# EAGLE schematic 6_cpu_registers_b (EAGLE 6.6.0)

## Sheet 1 of 2
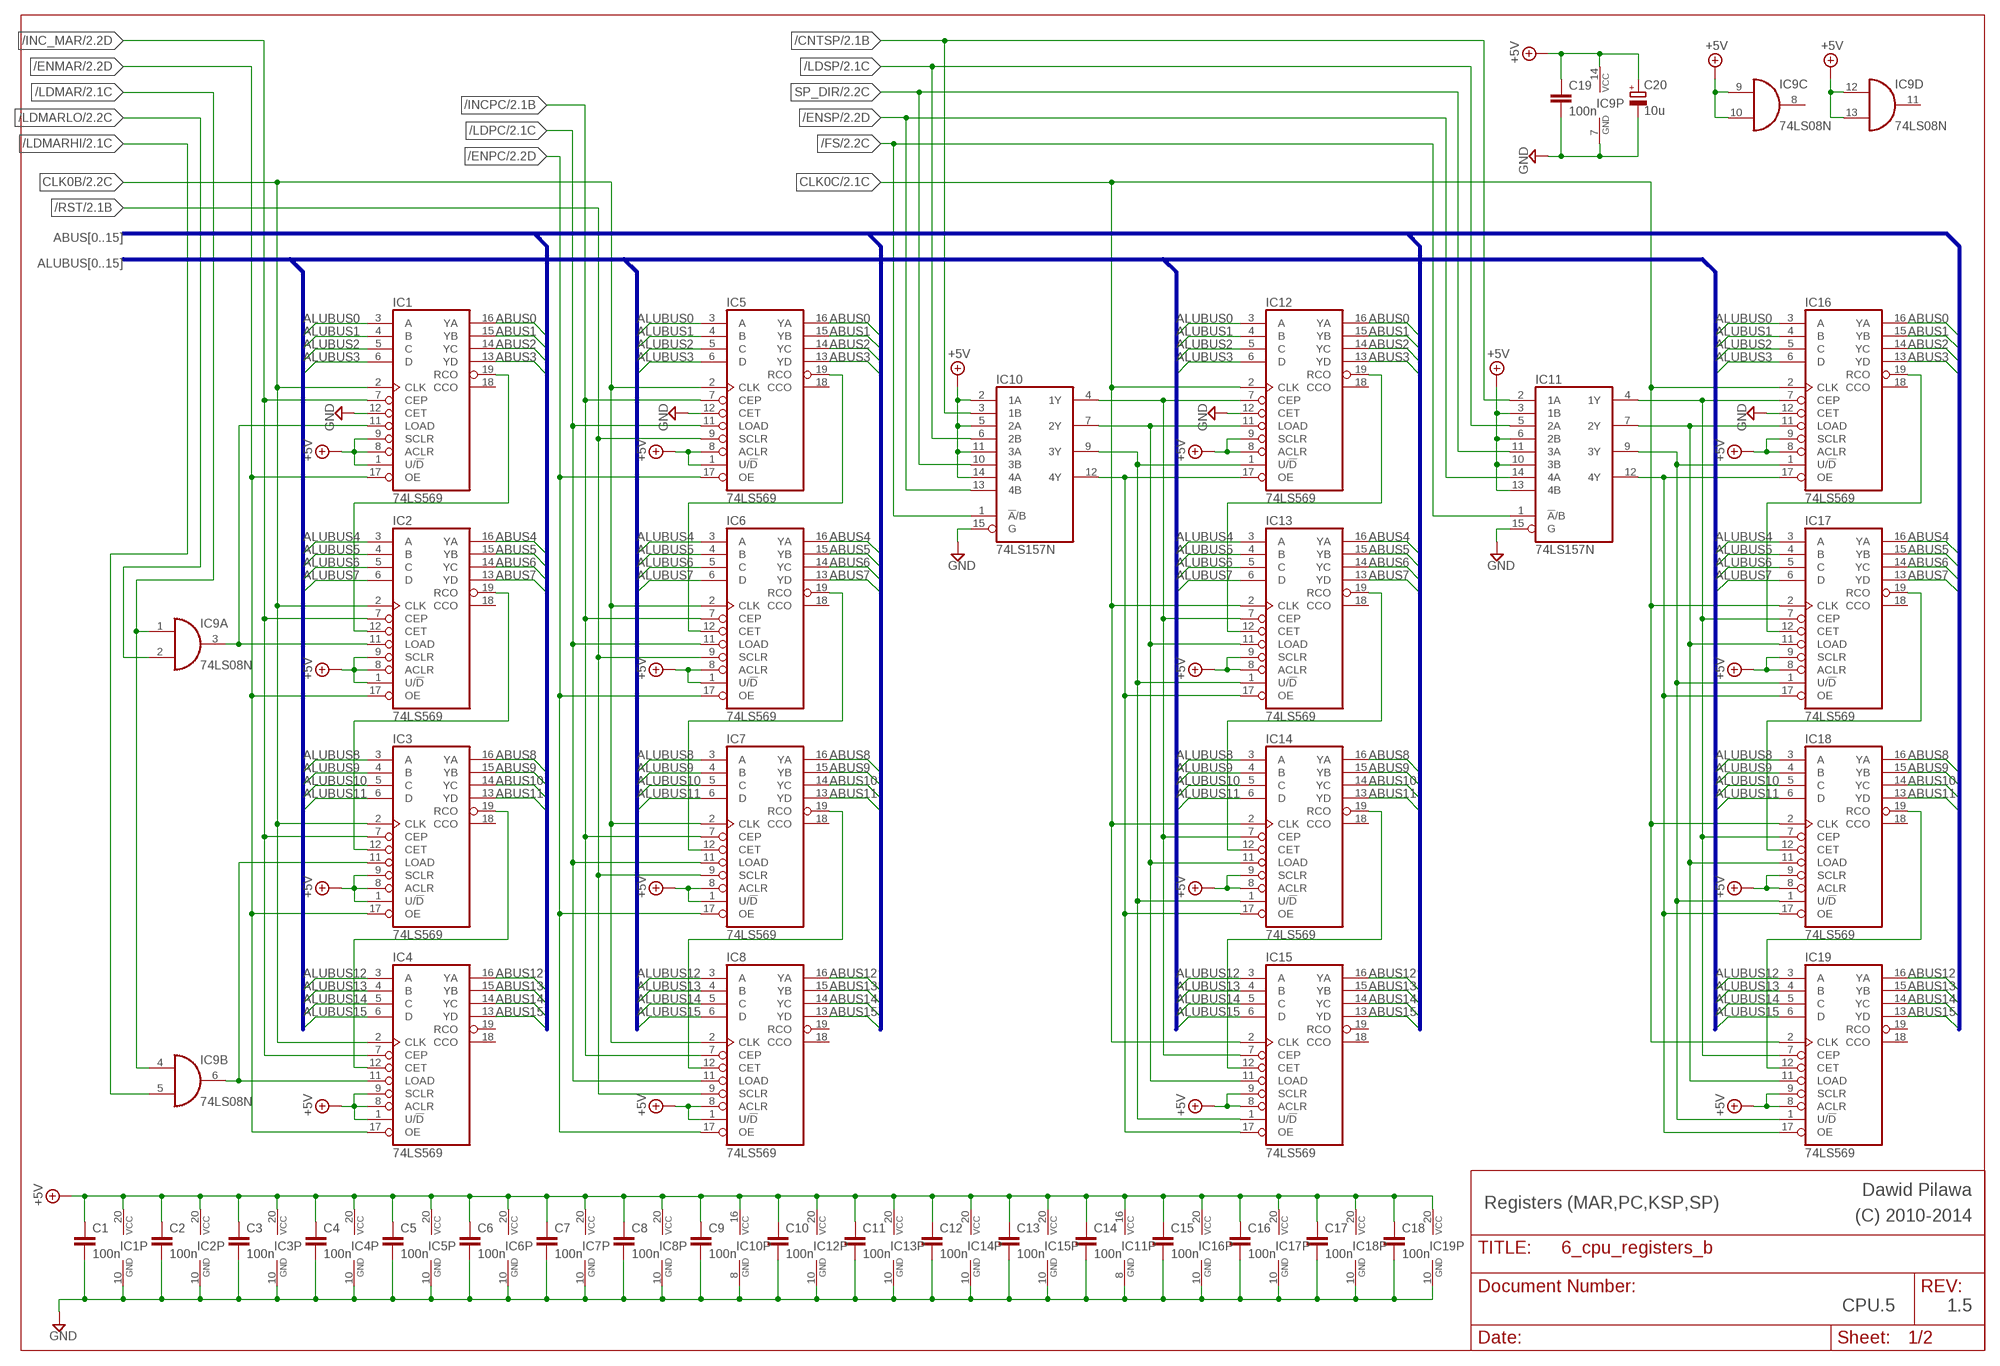
[diagram p0: schematic, sheet 1]

### Parts
C1  100n  C-EU050-024X044  [C050-024X044]
C2  100n  C-EU050-024X044  [C050-024X044]
C3  100n  C-EU050-024X044  [C050-024X044]
C4  100n  C-EU050-024X044  [C050-024X044]
C5  100n  C-EU050-024X044  [C050-024X044]
C6  100n  C-EU050-024X044  [C050-024X044]
C7  100n  C-EU050-024X044  [C050-024X044]
C8  100n  C-EU050-024X044  [C050-024X044]
C9  100n  C-EU050-024X044  [C050-024X044]
C10  100n  C-EU050-024X044  [C050-024X044]
C11  100n  C-EU050-024X044  [C050-024X044]
C12  100n  C-EU050-024X044  [C050-024X044]
C13  100n  C-EU050-024X044  [C050-024X044]
C14  100n  C-EU050-024X044  [C050-024X044]
C15  100n  C-EU050-024X044  [C050-024X044]
C16  100n  C-EU050-024X044  [C050-024X044]
C17  100n  C-EU050-024X044  [C050-024X044]
C18  100n  C-EU050-024X044  [C050-024X044]
C19  100n  C-EU050-024X044  [C050-024X044]
C20  10u  CPOL-EUE2.5-6  [E2,5-6]
IC1  74LS569  [DIL20]
IC2  74LS569  [DIL20]
IC3  74LS569  [DIL20]
IC4  74LS569  [DIL20]
IC5  74LS569  [DIL20]
IC6  74LS569  [DIL20]
IC7  74LS569  [DIL20]
IC8  74LS569  [DIL20]
IC9  74LS08N  [DIL14]
IC10  74LS157N  [DIL16]
IC11  74LS157N  [DIL16]
IC12  74LS569  [DIL20]
IC13  74LS569  [DIL20]
IC14  74LS569  [DIL20]
IC15  74LS569  [DIL20]
IC16  74LS569  [DIL20]
IC17  74LS569  [DIL20]
IC18  74LS569  [DIL20]
IC19  74LS569  [DIL20]

### Nets
+5V: C1.1 C2.1 C3.1 C4.1 C5.1 C6.1 C7.1 C8.1 C9.1 C10.1 C11.1 C12.1 C13.1 C14.1 C15.1 C16.1 C17.1 C18.1 C19.1 C20.+ IC1.1(U/!D) IC1.8(ACLR) IC1.9(SCLR) IC1.20(VCC) IC2.1(U/!D) IC2.8(ACLR) IC2.9(SCLR) IC2.20(VCC) IC3.1(U/!D) IC3.8(ACLR) IC3.9(SCLR) IC3.20(VCC) IC4.1(U/!D) IC4.8(ACLR) IC4.9(SCLR) IC4.20(VCC) IC5.1(U/!D) IC5.8(ACLR) IC5.20(VCC) IC6.1(U/!D) IC6.8(ACLR) IC6.20(VCC) IC7.1(U/!D) IC7.8(ACLR) IC7.20(VCC) IC8.1(U/!D) IC8.8(ACLR) IC8.20(VCC) IC9.9(C:I0) IC9.10(C:I1) IC9.12(D:I0) IC9.13(D:I1) IC9.14(P:VCC) IC10.2(1A) IC10.5(2A) IC10.11(3A) IC10.14(4A) IC10.16(VCC) IC11.3(1B) IC11.6(2B) IC11.10(3B) IC11.13(4B) IC11.16(VCC) IC12.8(ACLR) IC12.9(SCLR) IC12.20(VCC) IC13.8(ACLR) IC13.9(SCLR) IC13.20(VCC) IC14.8(ACLR) IC14.9(SCLR) IC14.20(VCC) IC15.8(ACLR) IC15.9(SCLR) IC15.20(VCC) IC16.8(ACLR) IC16.9(SCLR) IC16.20(VCC) IC17.8(ACLR) IC17.9(SCLR) IC17.20(VCC) IC18.8(ACLR) IC18.9(SCLR) IC18.20(VCC) IC19.8(ACLR) IC19.9(SCLR) IC19.20(VCC) ; also sheet 2
/CNTSP: IC10.3(1B) IC11.2(1A) ; also sheet 2
/ENMAR: IC1.17(OE) IC2.17(OE) IC3.17(OE) IC4.17(OE) ; also sheet 2
/ENPC: IC5.17(OE) IC6.17(OE) IC7.17(OE) IC8.17(OE) ; also sheet 2
/ENSP: IC10.13(4B) IC11.14(4A) ; also sheet 2
/FS: IC10.1(!A!/B) IC11.1(!A!/B) ; also sheet 2
/INC_MAR: IC1.7(CEP) IC2.7(CEP) IC3.7(CEP) IC4.7(CEP) ; also sheet 2
/INCPC: IC5.7(CEP) IC6.7(CEP) IC7.7(CEP) IC8.7(CEP) ; also sheet 2
/LDMAR: IC9.1(A:I0) IC9.4(B:I0) ; also sheet 2
/LDMARHI: IC9.5(B:I1) ; also sheet 2
/LDMARLO: IC9.2(A:I1) ; also sheet 2
/LDPC: IC5.11(LOAD) IC6.11(LOAD) IC7.11(LOAD) IC8.11(LOAD) ; also sheet 2
/LDSP: IC10.6(2B) IC11.5(2A) ; also sheet 2
/RST: IC5.9(SCLR) IC6.9(SCLR) IC7.9(SCLR) IC8.9(SCLR) ; also sheet 2
ABUS0: IC1.16(YA) IC5.16(YA) IC12.16(YA) IC16.16(YA) ; also sheet 2
ABUS1: IC1.15(YB) IC5.15(YB) IC12.15(YB) IC16.15(YB) ; also sheet 2
ABUS2: IC1.14(YC) IC5.14(YC) IC12.14(YC) IC16.14(YC) ; also sheet 2
ABUS3: IC1.13(YD) IC5.13(YD) IC12.13(YD) IC16.13(YD) ; also sheet 2
ABUS4: IC2.16(YA) IC6.16(YA) IC13.16(YA) IC17.16(YA) ; also sheet 2
ABUS5: IC2.15(YB) IC6.15(YB) IC13.15(YB) IC17.15(YB) ; also sheet 2
ABUS6: IC2.14(YC) IC6.14(YC) IC13.14(YC) IC17.14(YC) ; also sheet 2
ABUS7: IC2.13(YD) IC6.13(YD) IC13.13(YD) IC17.13(YD) ; also sheet 2
ABUS8: IC3.16(YA) IC7.16(YA) IC14.16(YA) IC18.16(YA) ; also sheet 2
ABUS9: IC3.15(YB) IC7.15(YB) IC14.15(YB) IC18.15(YB) ; also sheet 2
ABUS10: IC3.14(YC) IC7.14(YC) IC14.14(YC) IC18.14(YC) ; also sheet 2
ABUS11: IC3.13(YD) IC7.13(YD) IC14.13(YD) IC18.13(YD) ; also sheet 2
ABUS12: IC4.16(YA) IC8.16(YA) IC15.16(YA) IC19.16(YA) ; also sheet 2
ABUS13: IC4.15(YB) IC8.15(YB) IC15.15(YB) IC19.15(YB) ; also sheet 2
ABUS14: IC4.14(YC) IC8.14(YC) IC15.14(YC) IC19.14(YC) ; also sheet 2
ABUS15: IC4.13(YD) IC8.13(YD) IC15.13(YD) IC19.13(YD) ; also sheet 2
ALUBUS0: IC1.3(A) IC5.3(A) IC12.3(A) IC16.3(A) ; also sheet 2
ALUBUS1: IC1.4(B) IC5.4(B) IC12.4(B) IC16.4(B) ; also sheet 2
ALUBUS2: IC1.5(C) IC5.5(C) IC12.5(C) IC16.5(C) ; also sheet 2
ALUBUS3: IC1.6(D) IC5.6(D) IC12.6(D) IC16.6(D) ; also sheet 2
ALUBUS4: IC2.3(A) IC6.3(A) IC13.3(A) IC17.3(A) ; also sheet 2
ALUBUS5: IC2.4(B) IC6.4(B) IC13.4(B) IC17.4(B) ; also sheet 2
ALUBUS6: IC2.5(C) IC6.5(C) IC13.5(C) IC17.5(C) ; also sheet 2
ALUBUS7: IC2.6(D) IC6.6(D) IC13.6(D) IC17.6(D) ; also sheet 2
ALUBUS8: IC3.3(A) IC7.3(A) IC14.3(A) IC18.3(A) ; also sheet 2
ALUBUS9: IC3.4(B) IC7.4(B) IC14.4(B) IC18.4(B) ; also sheet 2
ALUBUS10: IC3.5(C) IC7.5(C) IC14.5(C) IC18.5(C) ; also sheet 2
ALUBUS11: IC3.6(D) IC7.6(D) IC14.6(D) IC18.6(D) ; also sheet 2
ALUBUS12: IC4.3(A) IC8.3(A) IC15.3(A) IC19.3(A) ; also sheet 2
ALUBUS13: IC4.4(B) IC8.4(B) IC15.4(B) IC19.4(B) ; also sheet 2
ALUBUS14: IC4.5(C) IC8.5(C) IC15.5(C) IC19.5(C) ; also sheet 2
ALUBUS15: IC4.6(D) IC8.6(D) IC15.6(D) IC19.6(D) ; also sheet 2
CLK0B: IC1.2(CLK) IC2.2(CLK) IC3.2(CLK) IC4.2(CLK) IC5.2(CLK) IC6.2(CLK) IC7.2(CLK) IC8.2(CLK) ; also sheet 2
CLK0C: IC12.2(CLK) IC13.2(CLK) IC14.2(CLK) IC15.2(CLK) IC16.2(CLK) IC17.2(CLK) IC18.2(CLK) IC19.2(CLK) ; also sheet 2
GND: C1.2 C2.2 C3.2 C4.2 C5.2 C6.2 C7.2 C8.2 C9.2 C10.2 C11.2 C12.2 C13.2 C14.2 C15.2 C16.2 C17.2 C18.2 C19.2 C20.- IC1.10(GND) IC1.12(CET) IC2.10(GND) IC3.10(GND) IC4.10(GND) IC5.10(GND) IC5.12(CET) IC6.10(GND) IC7.10(GND) IC8.10(GND) IC9.7(P:GND) IC10.8(GND) IC10.15(G) IC11.8(GND) IC11.15(G) IC12.10(GND) IC12.12(CET) IC13.10(GND) IC14.10(GND) IC15.10(GND) IC16.10(GND) IC16.12(CET) IC17.10(GND) IC18.10(GND) IC19.10(GND) ; also sheet 2
N$1: IC1.11(LOAD) IC2.11(LOAD) IC9.3(A:O)
N$2: IC6.19(RCO) IC7.12(CET)
N$3: IC5.19(RCO) IC6.12(CET)
N$4: IC7.19(RCO) IC8.12(CET)
N$5: IC12.19(RCO) IC13.12(CET)
N$6: IC13.19(RCO) IC14.12(CET)
N$7: IC3.11(LOAD) IC4.11(LOAD) IC9.6(B:O)
N$8: IC14.19(RCO) IC15.12(CET)
N$9: IC10.4(1Y) IC12.7(CEP) IC13.7(CEP) IC14.7(CEP) IC15.7(CEP)
N$10: IC1.19(RCO) IC2.12(CET)
N$11: IC2.19(RCO) IC3.12(CET)
N$12: IC3.19(RCO) IC4.12(CET)
N$13: IC10.7(2Y) IC12.11(LOAD) IC13.11(LOAD) IC14.11(LOAD) IC15.11(LOAD)
N$14: IC10.9(3Y) IC12.1(U/!D) IC13.1(U/!D) IC14.1(U/!D) IC15.1(U/!D)
N$15: IC11.9(3Y) IC16.1(U/!D) IC17.1(U/!D) IC18.1(U/!D) IC19.1(U/!D)
N$16: IC10.12(4Y) IC12.17(OE) IC13.17(OE) IC14.17(OE) IC15.17(OE)
N$17: IC11.12(4Y) IC16.17(OE) IC17.17(OE) IC18.17(OE) IC19.17(OE)
N$19: IC16.19(RCO) IC17.12(CET)
N$20: IC17.19(RCO) IC18.12(CET)
N$21: IC18.19(RCO) IC19.12(CET)
N$23: IC11.4(1Y) IC16.7(CEP) IC17.7(CEP) IC18.7(CEP) IC19.7(CEP)
N$24: IC11.7(2Y) IC16.11(LOAD) IC17.11(LOAD) IC18.11(LOAD) IC19.11(LOAD)
SP_DIR: IC10.10(3B) IC11.11(3A) ; also sheet 2
Unconnected: IC1.18(CCO) IC2.18(CCO) IC3.18(CCO) IC4.18(CCO) IC4.19(RCO) IC5.18(CCO) IC6.18(CCO) IC7.18(CCO) IC8.18(CCO) IC8.19(RCO) IC9.8(C:O) IC9.11(D:O) IC12.18(CCO) IC13.18(CCO) IC14.18(CCO) IC15.18(CCO) IC15.19(RCO) IC16.18(CCO) IC17.18(CCO) IC18.18(CCO) IC19.18(CCO) IC19.19(RCO)

### Buses
ALUBUS[0..15]
ABUS[0..15]

### Notes on the sheet
- Dawid Pilawa
- Registers (MAR,PC,KSP,SP) | (C) 2010-2014
- CPU.5 | 1.5

## Sheet 2 of 2
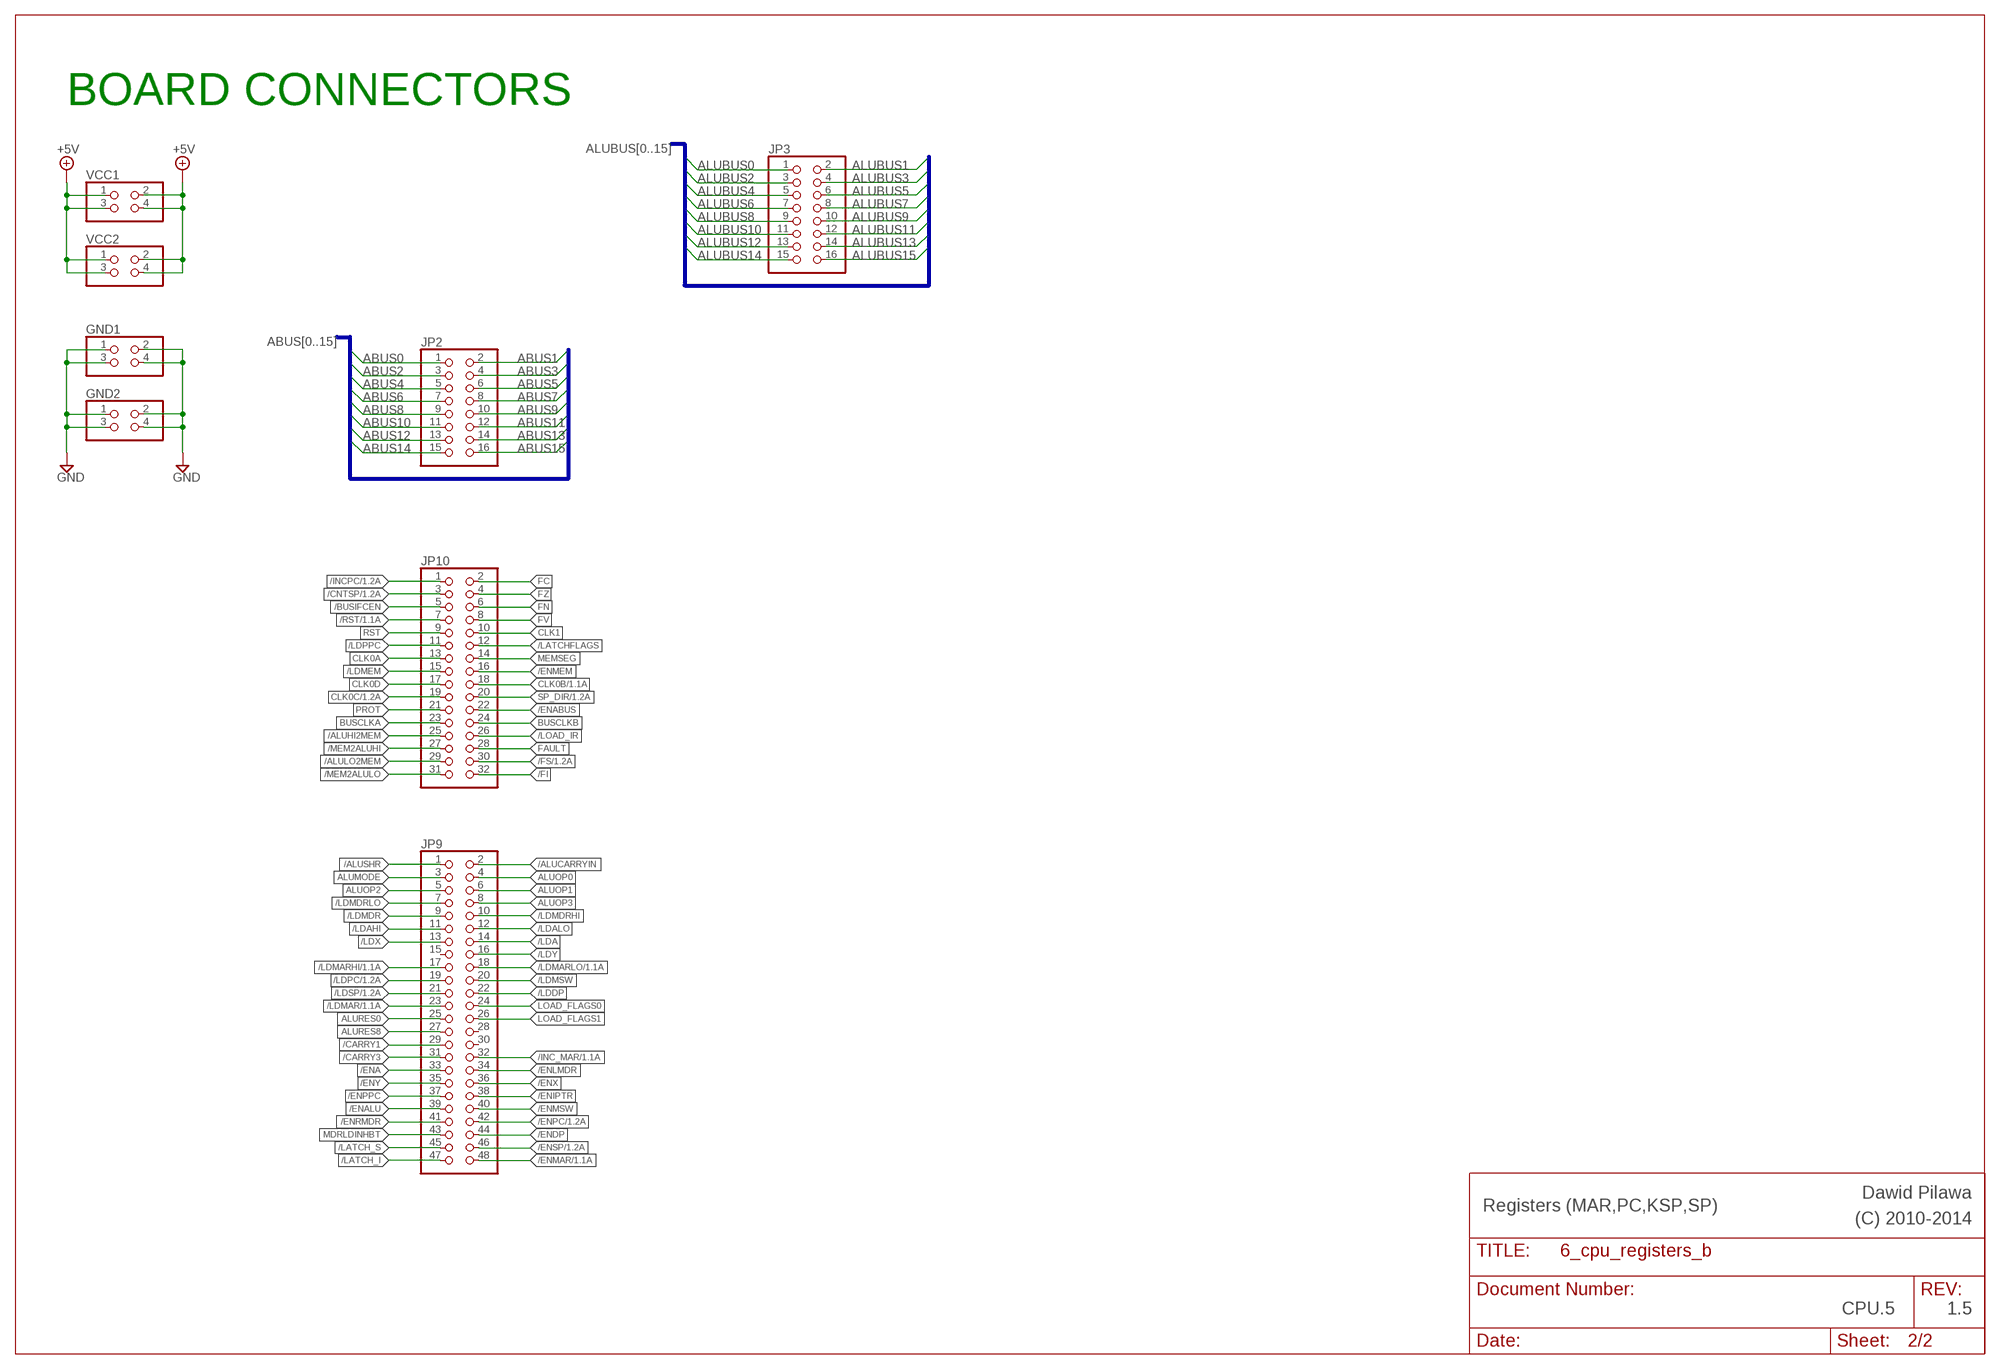
[diagram p1: schematic, sheet 2]

### Parts
GND1  PINHD-2X2  [2X02]
GND2  PINHD-2X2  [2X02]
JP2  PINHD-2X8  [2X08]
JP3  PINHD-2X8  [2X08]
JP9  PINHD-2X24  [2X24]
JP10  PINHD-2X16  [2X16]
VCC1  PINHD-2X2  [2X02]
VCC2  PINHD-2X2  [2X02]

### Nets
+5V: VCC1.1 VCC1.2 VCC1.3 VCC1.4 VCC2.1 VCC2.2 VCC2.3 VCC2.4 ; also sheet 1
/ALUCARRYIN: JP9.2
/ALUHI2MEM: JP10.25
/ALULO2MEM: JP10.29
/ALUSHR: JP9.1
/BUSIFCEN: JP10.5
/CARRY1: JP9.29
/CARRY3: JP9.31
/CNTSP: JP10.3 ; also sheet 1
/ENA: JP9.33
/ENABUS: JP10.22
/ENALU: JP9.39
/ENDP: JP9.44
/ENIPTR: JP9.38
/ENLMDR: JP9.34
/ENMAR: JP9.48 ; also sheet 1
/ENMEM: JP10.16
/ENMSW: JP9.40
/ENPC: JP9.42 ; also sheet 1
/ENPPC: JP9.37
/ENRMDR: JP9.41
/ENSP: JP9.46 ; also sheet 1
/ENX: JP9.36
/ENY: JP9.35
/FI: JP10.32
/FS: JP10.30 ; also sheet 1
/INC_MAR: JP9.32 ; also sheet 1
/INCPC: JP10.1 ; also sheet 1
/LATCH_I: JP9.47
/LATCH_S: JP9.45
/LATCHFLAGS: JP10.12
/LDA: JP9.14
/LDAHI: JP9.11
/LDALO: JP9.12
/LDDP: JP9.22
/LDMAR: JP9.23 ; also sheet 1
/LDMARHI: JP9.17 ; also sheet 1
/LDMARLO: JP9.18 ; also sheet 1
/LDMDR: JP9.9
/LDMDRHI: JP9.10
/LDMDRLO: JP9.7
/LDMEM: JP10.15
/LDMSW: JP9.20
/LDPC: JP9.19 ; also sheet 1
/LDPPC: JP10.11
/LDSP: JP9.21 ; also sheet 1
/LDX: JP9.13
/LDY: JP9.16
/LOAD_IR: JP10.26
/MEM2ALUHI: JP10.27
/MEM2ALULO: JP10.31
/RST: JP10.7 ; also sheet 1
ABUS0: JP2.1 ; also sheet 1
ABUS1: JP2.2 ; also sheet 1
ABUS2: JP2.3 ; also sheet 1
ABUS3: JP2.4 ; also sheet 1
ABUS4: JP2.5 ; also sheet 1
ABUS5: JP2.6 ; also sheet 1
ABUS6: JP2.7 ; also sheet 1
ABUS7: JP2.8 ; also sheet 1
ABUS8: JP2.9 ; also sheet 1
ABUS9: JP2.10 ; also sheet 1
ABUS10: JP2.11 ; also sheet 1
ABUS11: JP2.12 ; also sheet 1
ABUS12: JP2.13 ; also sheet 1
ABUS13: JP2.14 ; also sheet 1
ABUS14: JP2.15 ; also sheet 1
ABUS15: JP2.16 ; also sheet 1
ALUBUS0: JP3.1 ; also sheet 1
ALUBUS1: JP3.2 ; also sheet 1
ALUBUS2: JP3.3 ; also sheet 1
ALUBUS3: JP3.4 ; also sheet 1
ALUBUS4: JP3.5 ; also sheet 1
ALUBUS5: JP3.6 ; also sheet 1
ALUBUS6: JP3.7 ; also sheet 1
ALUBUS7: JP3.8 ; also sheet 1
ALUBUS8: JP3.9 ; also sheet 1
ALUBUS9: JP3.10 ; also sheet 1
ALUBUS10: JP3.11 ; also sheet 1
ALUBUS11: JP3.12 ; also sheet 1
ALUBUS12: JP3.13 ; also sheet 1
ALUBUS13: JP3.14 ; also sheet 1
ALUBUS14: JP3.15 ; also sheet 1
ALUBUS15: JP3.16 ; also sheet 1
ALUMODE: JP9.3
ALUOP0: JP9.4
ALUOP1: JP9.6
ALUOP2: JP9.5
ALUOP3: JP9.8
ALURES0: JP9.25
ALURES8: JP9.27
BUSCLKA: JP10.23
BUSCLKB: JP10.24
CLK0A: JP10.13
CLK0B: JP10.18 ; also sheet 1
CLK0C: JP10.19 ; also sheet 1
CLK0D: JP10.17
CLK1: JP10.10
FAULT: JP10.28
FC: JP10.2
FN: JP10.6
FV: JP10.8
FZ: JP10.4
GND: GND1.1 GND1.2 GND1.3 GND1.4 GND2.1 GND2.2 GND2.3 GND2.4 ; also sheet 1
LOAD_FLAGS0: JP9.24
LOAD_FLAGS1: JP9.26
MDRLDINHBT: JP9.43
MEMSEG: JP10.14
PROT: JP10.21
RST: JP10.9
SP_DIR: JP10.20 ; also sheet 1
Unconnected: JP9.15 JP9.28 JP9.30

### Buses
ALUBUS[0..15]
ABUS[0..15]

### Notes on the sheet
- BOARD CONNECTORS
- Dawid Pilawa
- Registers (MAR,PC,KSP,SP) | (C) 2010-2014
- CPU.5 | 1.5

## Library data of the parts
C1-C19 = rcl:C-EU: CAPACITOR, European symbol
C20 = rcl:CPOL-EU: POLARIZED CAPACITOR, European symbol
GND1 GND2 VCC1 VCC2 = pinhead:PINHD-2X2: PIN HEADER
IC1-IC8 IC12-IC19 = 74xx-eu:74*569: Synchronous binary up/down counter with three-state outputs
IC9 = 74xx-eu:74*08: Quad 2-input AND gate
IC10 IC11 = 74xx-eu:74*157: Quadruple 2-line to 1-line data SELECTOR/MULTIPLEXER
JP2 JP3 = pinhead:PINHD-2X8: PIN HEADER
JP9 = pinhead:PINHD-2X24: PIN HEADER
JP10 = pinhead:PINHD-2X16: PIN HEADER